# Altium schematic sheet FPGA_TSK51A_IO_Redirect_LCD_KeyPad.SchDoc: IO Redirection example
size B; DocumentNumber: 1; SheetNumber: 1; SheetTotal: 1
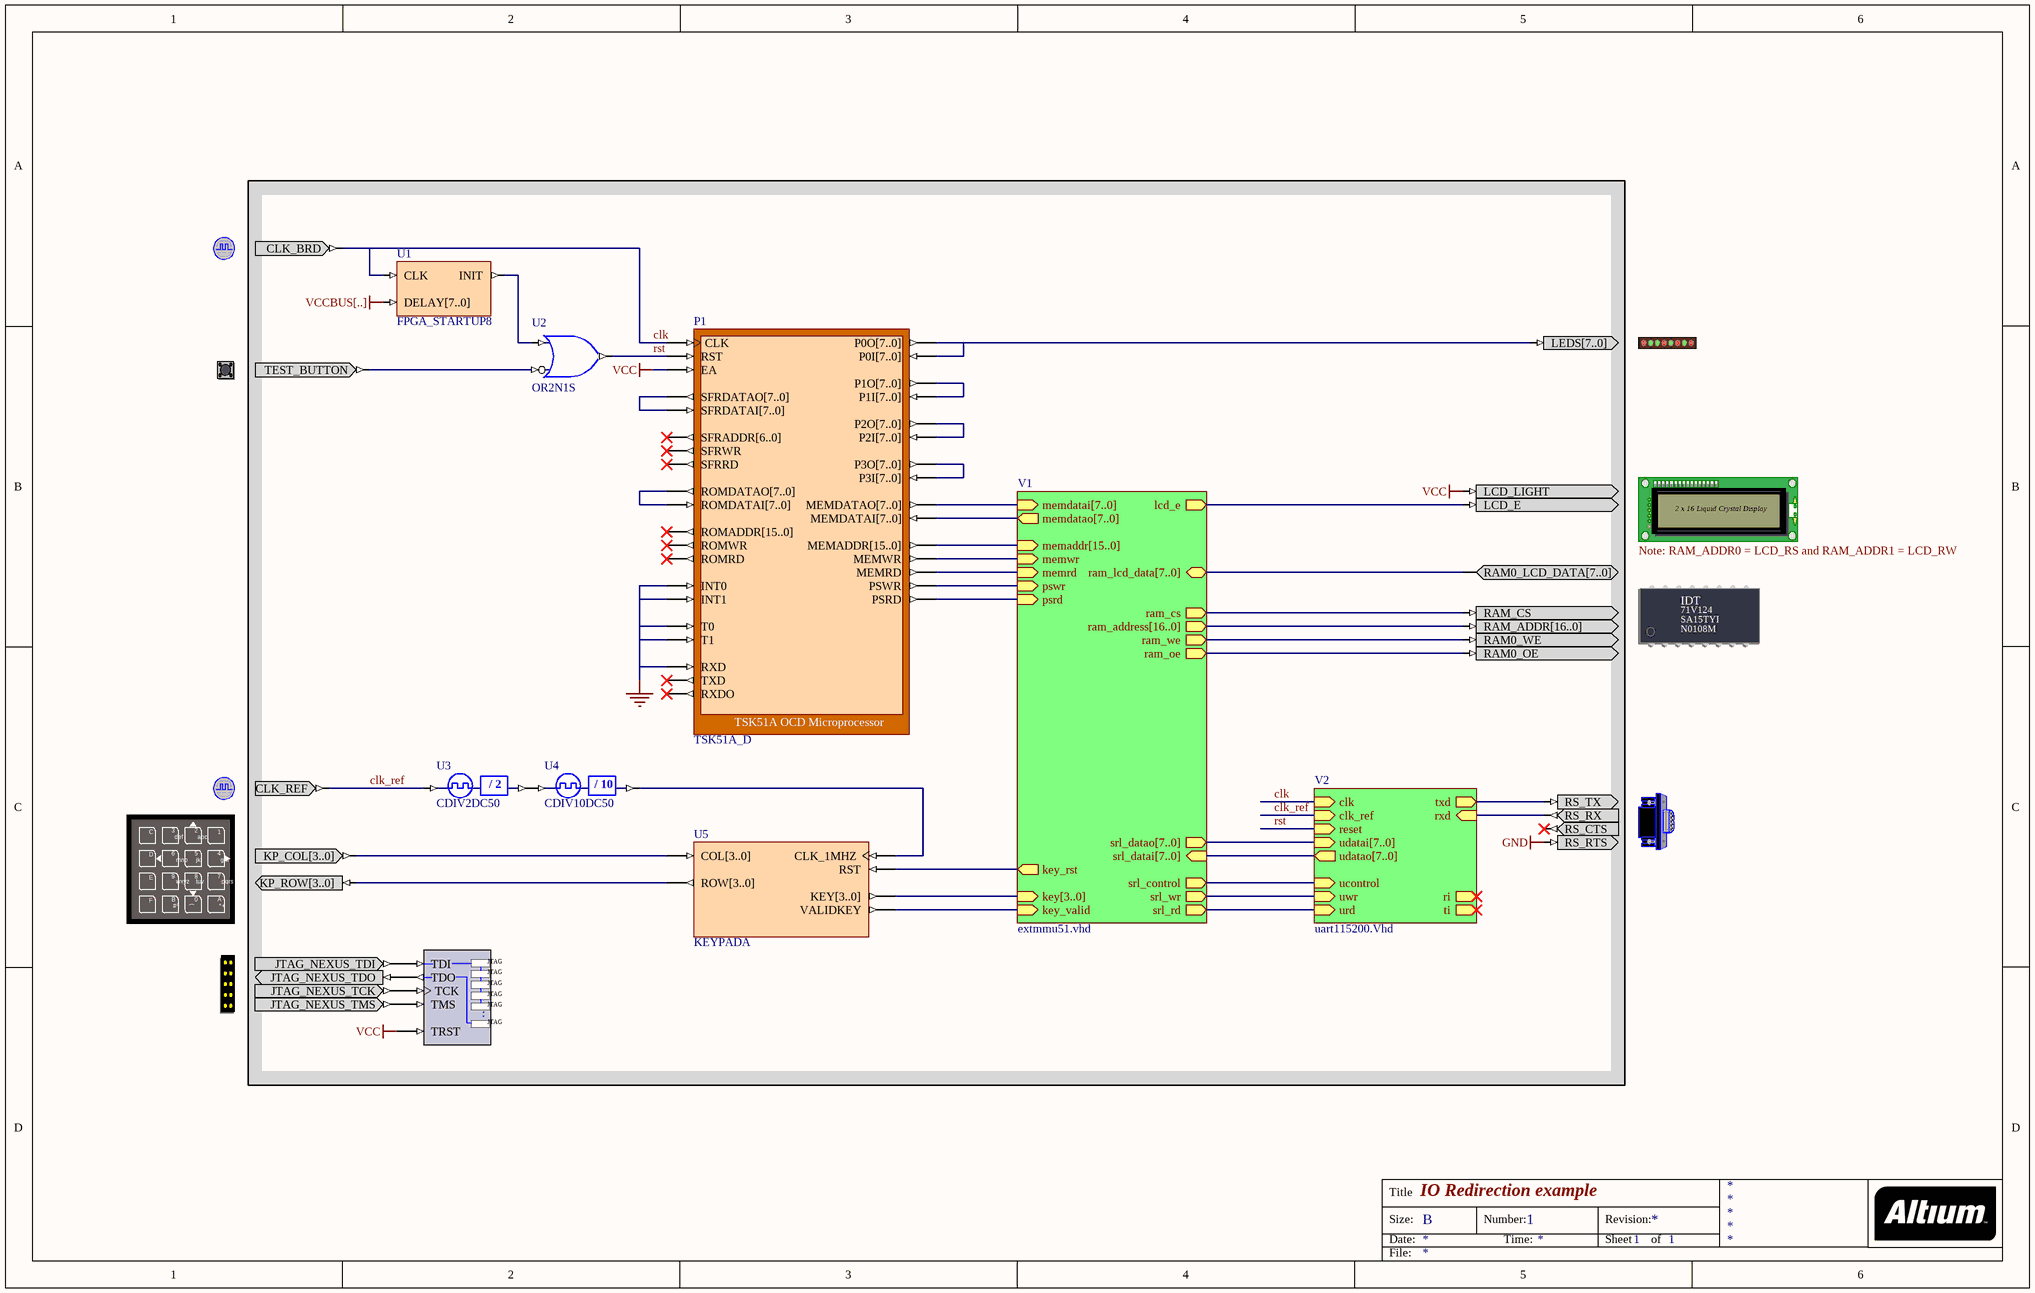
[diagram p0: FPGA_TSK51A_IO_Redirect_LCD_KeyPad.SchDoc]

## Parts
(Parts that share a designator on the sheet are numbered #1, #2 ... from top to bottom, then left to right.)
?#1  CLOCK_BOARD  (value not drawn)
?#2  LED  (value not drawn)
?#3  TEST_BUTTON  (value not drawn)
?#4  Note: RAM_ADDR0 = LCD_RS and RAM_ADDR1 = LCD_RW  (hidden comment: LCD_MEMORY0)
?#5  CLOCK_REFERENCE  (value not drawn)
?#6  RS232CNTR  (value not drawn)
?#7  KEYPAD  (value not drawn)
?#8  NEXUS_JTAG_CONNECTOR  (value not drawn)
NEXUS_JTAG_PORT  NEXUS_JTAG_PORT  (value not drawn)
P1  TSK51A_D
U1  FPGA_STARTUP8
U2  OR2N1S
U3  CDIV2DC50
U4  CDIV10DC50
U5  KEYPADA

## Sub-sheets
V1 = extmmu51.vhd: key[3..0] (in), key_rst (out), lcd_e (out), memaddr[15..0] (in), memdatai[7..0] (in), memdatao[7..0] (out), memrd (in), memwr (in), psrd (in), pswr (in), ram_address[16..0] (out), ram_cs (out), ram_lcd_data[7..0] (bidir), ram_oe (out), ram_we (out), srl_control (out), srl_datai[7..0] (in), srl_datao[7..0] (out), key_valid (in), srl_rd (out), srl_wr (out)  | VHDLENTITY: extmmu51
V2 = uart115200.Vhd: clk (in), clk_ref (in), reset (in), ri (out), rxd (in), ti (out), txd (out), ucontrol (in), udatai[7..0] (in), udatao[7..0] (out), urd (in), uwr (in)  | VHDLENTITY: uart115200

## Nets
GND: ?#6.RS_RTS P1.INT0 P1.INT1 P1.RXD P1.T0 P1.T1
VCC: ?#4.LCD_LIGHT NEXUS_JTAG_PORT.TRST P1.EA
VCCBUS[..]: U1.DELAY[7..0]
clk: ?#1.CLK_BRD P1.CLK U1.CLK ; sheet V2/clk
clk_ref: ?#5.CLK_REF U3.CLKIN ; sheet V2/clk_ref
rst: P1.RST U2.O ; sheet V2/reset
Net?#2_LEDS[7..0]: ?#2.LEDS[7..0] P1.P0I[7..0] P1.P0O[7..0]
Net?#3_TEST_BUTTON: ?#3.TEST_BUTTON U2.I0
Net?#4_LCD_E: ?#4.LCD_E ; sheet V1/lcd_e
Net?#4_RAM0_LCD_DATA[7..0]: ?#4.RAM0_LCD_DATA[7..0] ; sheet V1/ram_lcd_data[7..0]
Net?#4_RAM0_OE: ?#4.RAM0_OE ; sheet V1/ram_oe
Net?#4_RAM0_WE: ?#4.RAM0_WE ; sheet V1/ram_we
Net?#4_RAM_ADDR[16..0]: ?#4.RAM_ADDR[16..0] ; sheet V1/ram_address[16..0]
Net?#4_RAM_CS: ?#4.RAM_CS ; sheet V1/ram_cs
Net?#6_RS_RX: ?#6.RS_RX ; sheet V2/rxd
Net?#6_RS_TX: ?#6.RS_TX ; sheet V2/txd
Net?#7_KP_COL[3..0]: ?#7.KP_COL[3..0] U5.COL[3..0]
Net?#7_KP_ROW[3..0]: ?#7.KP_ROW[3..0] U5.ROW[3..0]
Net?#8_JTAG_NEXUS_TCK: ?#8.JTAG_NEXUS_TCK NEXUS_JTAG_PORT.TCK
Net?#8_JTAG_NEXUS_TDI: ?#8.JTAG_NEXUS_TDI NEXUS_JTAG_PORT.TDI
Net?#8_JTAG_NEXUS_TDO: ?#8.JTAG_NEXUS_TDO NEXUS_JTAG_PORT.TDO
Net?#8_JTAG_NEXUS_TMS: ?#8.JTAG_NEXUS_TMS NEXUS_JTAG_PORT.TMS
NetP1_MEMADDR[15..0]: P1.MEMADDR[15..0] ; sheet V1/memaddr[15..0]
NetP1_MEMDATAI[7..0]: P1.MEMDATAI[7..0] ; sheet V1/memdatao[7..0]
NetP1_MEMDATAO[7..0]: P1.MEMDATAO[7..0] ; sheet V1/memdatai[7..0]
NetP1_MEMRD: P1.MEMRD ; sheet V1/memrd
NetP1_MEMWR: P1.MEMWR ; sheet V1/memwr
NetP1_P1I[7..0]: P1.P1I[7..0] P1.P1O[7..0]
NetP1_P2I[7..0]: P1.P2I[7..0] P1.P2O[7..0]
NetP1_P3I[7..0]: P1.P3I[7..0] P1.P3O[7..0]
NetP1_PSRD: P1.PSRD ; sheet V1/psrd
NetP1_PSWR: P1.PSWR ; sheet V1/pswr
NetP1_ROMDATAI[7..0]: P1.ROMDATAI[7..0] P1.ROMDATAO[7..0]
NetP1_SFRDATAI[7..0]: P1.SFRDATAI[7..0] P1.SFRDATAO[7..0]
NetU1_INIT: U1.INIT U2.I1
NetU3_CLKDV: U3.CLKDV U4.CLKIN
NetU4_CLKDV: U4.CLKDV U5.CLK_1MHZ
NetU5_KEY[3..0]: U5.KEY[3..0] ; sheet V1/key[3..0]
NetU5_RST: U5.RST ; sheet V1/key_rst
NetU5_VALIDKEY: U5.VALIDKEY ; sheet V1/key_valid
(unnamed): sheet V1/srl_control, sheet V2/ucontrol
(unnamed): sheet V1/srl_rd, sheet V2/urd
(unnamed): sheet V1/srl_wr, sheet V2/uwr

Not connected (* = marked no-connect by the designer): ?#6 RS_CTS*; P1 ROMADDR[15..0]* ROMRD* ROMWR* RXDO* SFRADDR[6..0]* SFRRD* SFRWR* TXD*

## Buses and harness runs
bus sheet V1/srl_datai[7..0] = sheet V2/udatao[7..0]
bus sheet V1/srl_datao[7..0] = sheet V2/udatai[7..0]

## Notes on the sheet
- Title
- Size:
- Date:
- B
- Number:
- Time:
- Revision:
- Sheet
- of
- File:
- (in symbol CDIV2DC50) / 2
- (in symbol CDIV10DC50) / 10
- (in symbol KEYPAD) C; 3; 2; 1; def; abc; 6; 5; 4; D; mno; jkl; ghi; E; 9; 8; 7; wxyz; tuv; pqrs; F; B; 0; A; #^; (; *+
- (in symbol LCD_MEMORY0) 2 x 16 Liquid Crystal Display; IDT; 71V124; SA15TYI; N0108M
- (in symbol NEXUS_JTAG_PORT) .

## Library data of the parts
?#1 = CLOCK_BOARD: Global System Clock Supply; PortComponent: True; Published: 19-Nov-2003; Publisher: Altium Limited; HelpURL: TR0102 NanoBoard Technical Reference Manual - NB1.pdf#page=29
?#2 = LED: 8-Way LEDS; PortComponent: True; Published: 19-Nov-2003; Publisher: Altium Limited
?#3 = TEST_BUTTON: Test Button; PortComponent: True; Published: 19-Nov-2003; Publisher: Altium Limited
?#4 = LCD_MEMORY0: Liquid Crystal Display and SRAM - 0 Module; PortComponent: True; Published: 19-Nov-2003; Publisher: Altium Limited
?#5 = CLOCK_REFERENCE: Global System Clock Reference Supply; PortComponent: True; Published: 19-Nov-2003; Publisher: Altium Limited; HelpURL: TR0102 NanoBoard Technical Reference Manual - NB1.pdf#page=29
?#6 = RS232CNTR: DCE Serial Port Connector; PortComponent: True; Published: 19-Nov-2003; Publisher: Altium Limited
?#7 = KEYPAD: Key Pad; PortComponent: True; Published: 19-Nov-2003; Publisher: Altium Limited
?#8 = NEXUS_JTAG_CONNECTOR: JTAG Port; PortComponent: True; Published: 19-Nov-2003; Publisher: Altium Limited
NEXUS_JTAG_PORT = NEXUS_JTAG_PORT: Soft Nexus-Chain Connector; NEXUS_JTAG_CONNECTOR: True; FunctionalClass: JTAG; Published: 29-Jan-2004; Publisher: Altium Limited; LastRevisionNo: 1.00.00; HelpURL: CR0118 FPGA Generic Library Guide.pdf#page=399
P1 = TSK51A_D: TSK51A OCD Microprocessor; NEXUS_CORE: Processor_OCDS; NEXUS_JTAG_DEVICE: True; NEXUS_JTAG_ORDER: 0; ChildModel1: RAM256x8_TSK51D; Published: 18/12/2003; Publisher: Altium Hobart Technology Centre; Core Revision: 1.00.00
U1 = FPGA_STARTUP8: FPGA Startup With 8 Bit Delay; Published: 21/01/2004; Publisher: Altium Hobart Technology Centre; Core Revision: 1.00.00
U2 = OR2N1S: 2-Input OR Gate with Active Low A Input, Single Pin Version; XilinxEquivalent: OR2B1; FunctionalClass: Logic Primitive; PortSize: 2; ArchiveName: GENERIC; VHDLIB_SIM: GENERIC_LIB; Published: 29-Jan-2004; Publisher: Altium Limited; LastRevisionNo: 1.00.00; HelpURL: CR0118 FPGA Generic Library Guide.pdf#page=404; SubClass: OR; PortStyle: Single Pin Version
U3 = CDIV2DC50: Clock Divider by 2 with 50% Duty Cycle Output; XilinxEquivalent: CLK_DIV2; DivisorRate: 2; DutyCycle: 50; ArchiveName: GENERIC; VHDLIB_SIM: GENERIC_LIB; Published: 29-Jan-2004; Publisher: Altium Limited; LastRevisionNo: 1.00.00; HelpURL: CR0118 FPGA Generic Library Guide.pdf#page=142; ComponentLink1URL: CR0127 FPGA Clock Divider Resource Usage.pdf#page=3; ComponentLink1Description: Core &Resource Usage; FunctionalClass: Clock Divider
U4 = CDIV10DC50: Clock Divider by 10 with 50% Duty Cycle Output; XilinxEquivalent: CLK_DIV10; DivisorRate: 10; DutyCycle: 50; ArchiveName: GENERIC; VHDLIB_SIM: GENERIC_LIB; Published: 29-Jan-2004; Publisher: Altium Limited; LastRevisionNo: 1.00.00; HelpURL: CR0118 FPGA Generic Library Guide.pdf#page=142; ComponentLink1URL: CR0127 FPGA Clock Divider Resource Usage.pdf#page=15; ComponentLink1Description: Core &Resource Usage; FunctionalClass: Clock Divider
U5 = KEYPADA: Keypad; Published: 2/01/2004; Publisher: Altium Hobart Technology Centre; Core Revision: 1.00.00